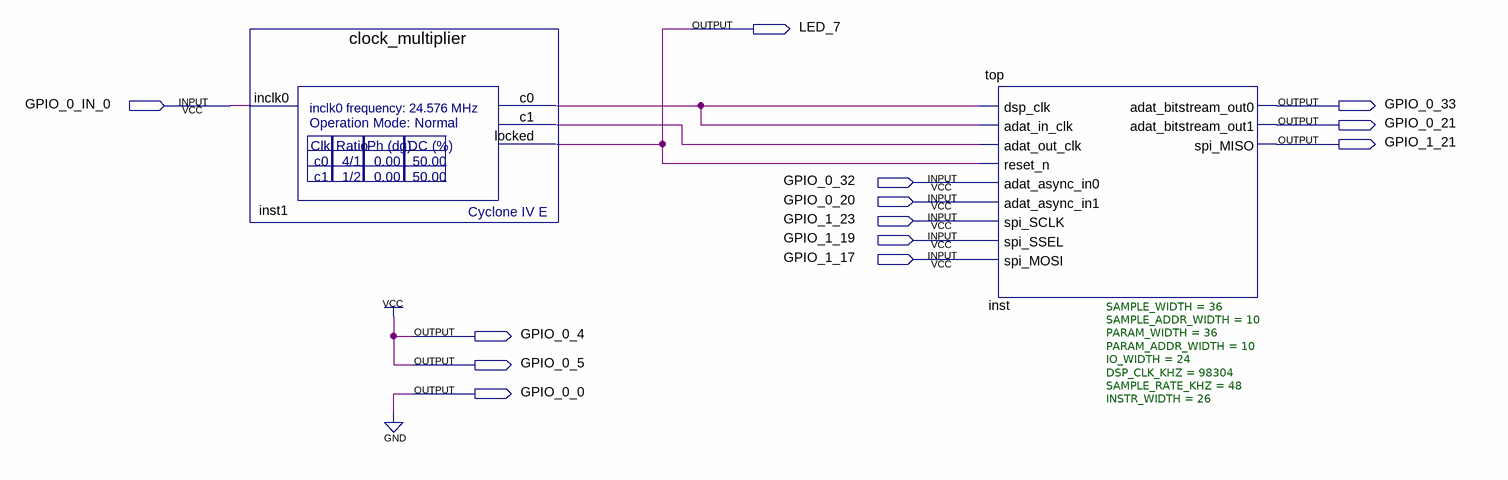
[diagram p0: schematic sheet]
// Quartus schematic mixer.bdf as structural Verilog: 2 symbols, 13 pins
module mixer (
  input  GPIO_0_IN_0,
  input  GPIO_0_32,
  input  GPIO_0_20,
  input  GPIO_1_23,
  input  GPIO_1_19,
  input  GPIO_1_17,
  output LED_7,
  output GPIO_0_33,
  output GPIO_0_21,
  output GPIO_1_21,
  output GPIO_0_4,
  output GPIO_0_5,
  output GPIO_0_0
);

  wire inst1_c0, inst1_c1;

  clock_multiplier inst1 (.inclk0(GPIO_0_IN_0), .c0(inst1_c0), .c1(inst1_c1), .locked(LED_7));
  top #(.SAMPLE_WIDTH(36), .SAMPLE_ADDR_WIDTH(10), .PARAM_WIDTH(36), .PARAM_ADDR_WIDTH(10), .IO_WIDTH(24), .DSP_CLK_KHZ(98304), .SAMPLE_RATE_KHZ(48), .INSTR_WIDTH(26)) inst (
    .dsp_clk(inst1_c0), .adat_in_clk(inst1_c0), .adat_out_clk(inst1_c1), .reset_n(LED_7),
    .adat_async_in0(GPIO_0_32), .adat_async_in1(GPIO_0_20), .spi_SCLK(GPIO_1_23), .spi_SSEL(GPIO_1_19),
    .spi_MOSI(GPIO_1_17), .adat_bitstream_out0(GPIO_0_33), .adat_bitstream_out1(GPIO_0_21),
    .spi_MISO(GPIO_1_21));

  assign GPIO_0_0 = 1'b0;
  assign GPIO_0_4 = 1'b1;
  assign GPIO_0_5 = 1'b1;
endmodule
